# Altium project LocalizationBoard.PrjPcb
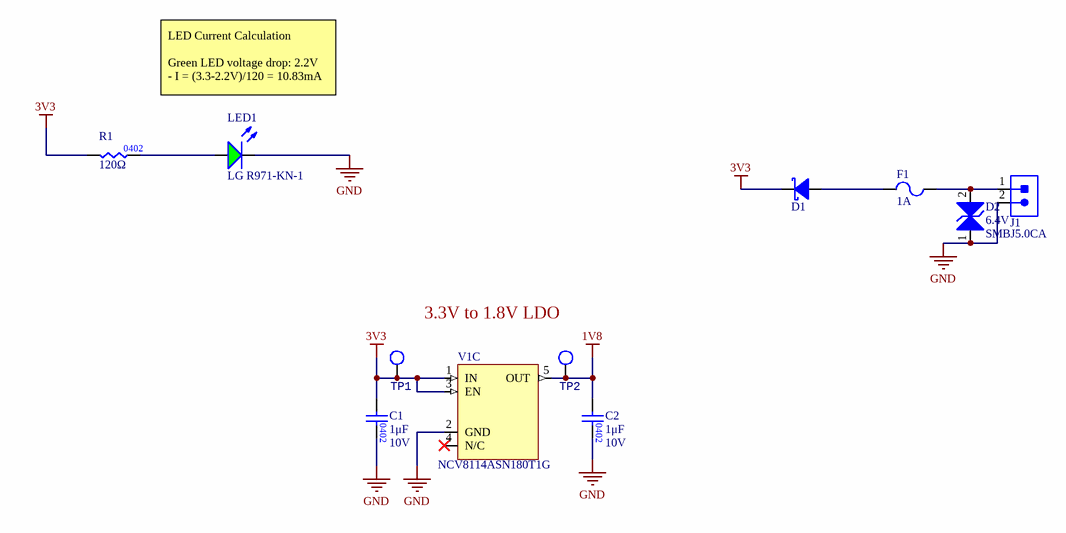
[diagram p0: Power.SchDoc]
designer: Logan Hartford; reviewer: Ari Wasch; total sheets: 6; version: 6.0
2 sheets, 25 parts. Net scope: flat (ports and power ports of the same name join across sheets).
Sheets:
  Power.SchDoc
  CAN.SchDoc

## Sheet Power.SchDoc
size 279 x 215 mm

### Parts
C1  Capacitance: 1μF  Rated DC Voltage (URdc): 10V  [CAP0402]  (hidden comment: CAP_1UF_10V_0402_X5R)
C2  Capacitance: 1μF  Rated DC Voltage (URdc): 10V  [CAP0402]  (hidden comment: CAP_1UF_10V_0402_X5R)
D1  DIO_SCHOTTKY_30V_800mA  [SOD-323_UNIDIR]  (value not drawn)
D2  Voltage - Breakdown (Min): 6.4V  Manufacturer Part Number 1: SMBJ5.0CA  [TVS_DIODE_BIDIR_SMB]  (hidden comment: TVS_DIODE_BIDIR_5V)
F1  Current Rating: 1A  [FUSE_1206]  (hidden comment: FUSE_1A_1206)
J1  CON_2POS_SCREW_TERM  [1935161]  (value not drawn)
LED1  Manufacturer Part Number 1: LG R971-KN-1  [LED_0805_GREEN]  (hidden comment: LED_GREEN)
R1  value 120Ω  [RES0402]
TP1  TESTPOINT_LOOP  [TESTPOINT_LOOP]  (value not drawn)
TP2  TESTPOINT_LOOP  [TESTPOINT_LOOP]  (value not drawn)
V1  NCV8114ASN180T1G  [1.8V_Output_LDO]  (part C of 3)

### Nets
1V8: C2.1 TP2.1 V1.5(OUT)
3V3: C1.1 D1.2(Cathode) R1.1 TP1.1 V1.1(IN) V1.3(EN)
GND: C1.2 C2.2 D2.1 J1.2 LED1.2(K) V1.2(GND)
NetD1_1: D1.1(Anode) F1.1
NetD2_2: D2.2 F1.2 J1.1
NetLED1_1: LED1.1(A) R1.2

Not connected (* = marked no-connect by the designer): V1 4(N/C)*

### Notes on the sheet
- LED Current Calculation
  Green LED voltage drop: 2.2V
  - I = (3.3-2.2V)/120 = 10.83mA
- 3.3V to 1.8V LDO
- University of Waterloo Robotics Team
- 200 University Ave W
- REV
- PROJECT
- Waterloo, Ontario, Canada
- N2L 3G1
- DOCUMENT
- ENGINEER
- REVIEWER
- MODIFIED
- SHEET
- OF

### Library data of the parts
C1 C2 = CAP_1UF_10V_0402_X5R: CAP CER 1UF 10V X5R 0402; Manufacturer: Kyocera AVX; Manufacturer Part Number: 0402ZD105MAT2A; Supplier 1: Digi-Key; Supplier Part Number 1: 478-5768-1-ND; Mounting Type: Surface Mount; Package: 0402; Temperature Characteristics Code: X5R; ComponentLink7URL: https://datasheet.ciiva.com/11531/cx5r-11531784.pdf?src-supplier=Avnet; ComponentLink7Description: https://datasheet.ciiva.com/11531/cx5r-11531784.pdf?src-supplier=Avnet
D1 = DIO_SCHOTTKY_30V_800mA: DIODE SCHOTTKY 30V 800MA USC; Manufacturer 1: Toshiba Semiconductor and Storage; Manufacturer Part Number 1: CUS08F30,H3F; Vf (Max): 220mV; Supplier 1: Digi-Key; Supplier Part Number 1: CUS08F30H3FCT-ND; Mounting Type: SMD; Vr (Max): 30V; Io: 800mA
D2 = TVS_DIODE_BIDIR_5V: TVS DIODE 5V 9.2V SMB; Manufacturer 1: Littelfuse; Package/Footprint: SMB; Supplier Part Number 1: SMBJ5.0CALFCT-ND; Supplier 1: Digi-Key; Mounting Type: SMD; Voltage - Reverse Standoff (Typ): 5V; Voltage - Clamping (Max) @ Ipp: 9.2V; Verified: No; LCSC Part #: *
F1 = FUSE_1A_1206: FUSE BOARD MOUNT 1A 125VAC 63VDC; Manufacturer 1: Bel Fuse Inc.; Manufacturer Part Number 1: C1Q 1; Package/Footprint: 1206; Supplier 1: Digi-Key; Supplier Part Number 1: 507-1077-1-ND; Mounting Type: SMD; LCSC Part #: *
J1 = CON_2POS_SCREW_TERM: TERM BLK 2POS SIDE ENTRY 5MM; Manufacturer 1: Phoenix Contact; Package/Footprint: SMD; Supplier 1: Digi-Key; Mounting Type: TH; Supplier Part Number 1: 277-1667-ND; Manufacturer Part Number 1: 1935161
LED1 = LED_GREEN: LED GREEN DIFFUSED 0805 SMD; Manufacturer 1: OSRAM; Forward Voltage Drop: 2.2V; Package/Footprint: 0805; Supplier Part Number 1: 475-1410-1-ND; Supplier 1: Digi-Key; Mounting Type: SMD
R1 = RES_120Ω_0402_5%: RES 120 OHM 5% 1/16W 0402; Manufacturer Part Number 1: RC0402JR-07120RL; Manufacturer 1: Yageo; Package/Footprint: 0402; Supplier 1: Digi-Key; Supplier Part Number 1: 311-120JRCT-ND; Mounting Type: SMD; Power: 1/16W; Tolerance: 5%
TP1 TP2 = TESTPOINT_LOOP: TESTPOINT THRUHOLE; Manufacturer 1: Keystone Electronics; Manufacturer Part Number 1: 5002; Package/Footprint: TH; Supplier Part Number 1: 36-5002-ND; Supplier 1: Digi-Key; Mounting Type: TH
V1 = 1.8V_Output_LDO: Linear Voltage Regulator IC Positive Fixed 1 Output 300mA 5-TSOP; Manufacture: onsemi; Output voltage: 1.8V; Manufacture part number: NCV8114ASN180T1G; Package: SOT-23-5 Thin, TSOT-23-5; Mounting type: Surface Mount; Supplier: Digikey; ComponentLink1Description: Datasheet; ComponentLink1URL: https://www.digikey.ca/en/products/detail/onsemi/NCV8114ASN180T1G/7066765

## Sheet CAN.SchDoc
size A4
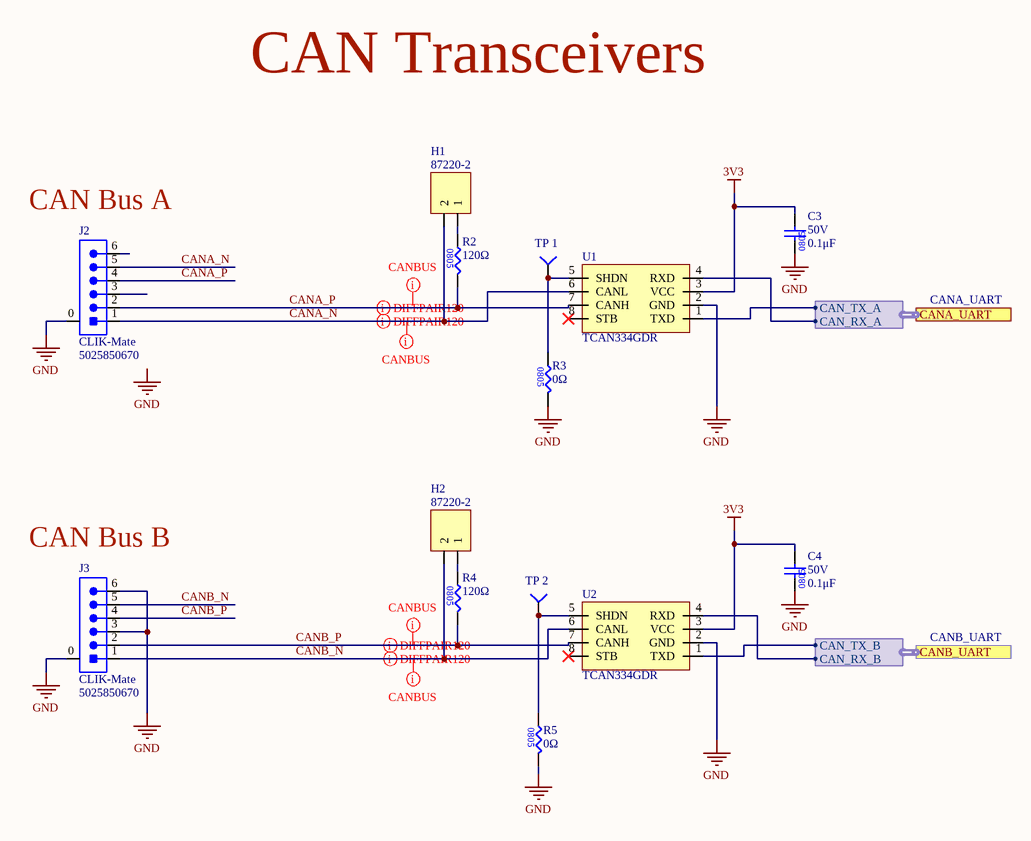
[diagram p1: CAN.SchDoc]

### Parts
C3  value 0.1μF  Voltage Rating: 50V  [CAP2012]  (hidden comment: CAP_0.1uF_50V_0805)
C4  value 0.1μF  Voltage Rating: 50V  [CAP2012]  (hidden comment: CAP_0.1uF_50V_0805)
H1  Manufacturer Part Number 1: 87220-2  [HDR1X2]  (hidden comment: JUMPER_2)
H2  Manufacturer Part Number 1: 87220-2  [HDR1X2]  (hidden comment: JUMPER_2)
J2  Family: CLIK-Mate  Manufacturer Part Number 1: 5025850670  [MOLEX-5025850670]  (hidden comment: CON_6M_SM_RA_1.5mm)
J3  Family: CLIK-Mate  Manufacturer Part Number 1: 5025850670  [MOLEX-5025850670]  (hidden comment: CON_6M_SM_RA_1.5mm)
R2  value 120Ω  [RES0805]  (hidden comment: RES_120Ω_0805_1%)
R3  value 0Ω  [RES0805]  (hidden comment: RES_0Ω_0805)
R4  value 120Ω  [RES0805]  (hidden comment: RES_120Ω_0805_1%)
R5  value 0Ω  [RES0805]  (hidden comment: RES_0Ω_0805)
TP_1  TESTPOINT_1MM_CIRCLE  [TESTPOINT_CIRCLE_1MM]  (value not drawn)  (no BOM)
TP_2  TESTPOINT_1MM_CIRCLE  [TESTPOINT_CIRCLE_1MM]  (value not drawn)  (no BOM)
U1  Manufacturer Part Number 1: TCAN334GDR  [SOIC127P600X175-8N]  (hidden comment: IC_CAN_TRANSCEIVER)
U2  Manufacturer Part Number 1: TCAN334GDR  [SOIC127P600X175-8N]  (hidden comment: IC_CAN_TRANSCEIVER)

### Ports
CANA_UART (harness CANA_UART), CANB_UART (harness CANB_UART)

### Harnesses
CANA_UART: CAN_RX_A, CAN_TX_A
CANB_UART: CAN_RX_B, CAN_TX_B

### Nets
3V3: C3.2 C4.2 U1.3(VCC) U2.3(VCC)
GND: C3.1 C4.1 J2.0 J3.0 J3.3 J3.6 R3.2 R5.2 U1.2(GND) U2.2(GND)
CANA_N: H1.2 J2.1 J2.5 U1.6(CANL)
CANA_P: J2.2 J2.4 R2.2 U1.7(CANH)
CANB_N: H2.2 J3.1 J3.5 U2.6(CANL)
CANB_P: J3.2 J3.4 R4.2 U2.7(CANH)
NetH1_1: H1.1 R2.1
NetH2_1: H2.1 R4.1
NetR3_1: R3.1 TP_1.1(=value) U1.5(SHDN)
NetR5_1: R5.1 TP_2.1(=value) U2.5(SHDN)
NetU1_1: U1.1(TXD) ; port CANA_UART.CAN_TX_A
NetU1_4: U1.4(RXD) ; port CANA_UART.CAN_RX_A
NetU2_1: U2.1(TXD) ; port CANB_UART.CAN_TX_B
NetU2_4: U2.4(RXD) ; port CANB_UART.CAN_RX_B

Not connected (* = marked no-connect by the designer): J2 3 6; U1 8(STB)*; U2 8(STB)*

### Layout directives
differential pair; differential pair class CANBUS120: CANA_N, CANA_P, CANB_N, CANB_P
mark named CANBUS: (no net found under the mark), CANA_N, CANB_N, CANB_P

### Notes on the sheet
- CAN Transceivers
- (near J2) CAN Bus A
- (near J3) CAN Bus B
- Labels drawn without touching a wire or pin: GND

### Library data of the parts
C3 C4 = CAP_0.1uF_50V_0805: CAP CER 0.1UF 50V X7R 0805; Manufacturer Part Number 1: GCM21BR71H104KA37K; Manufacturer 1: Murata Electronics; Package/Footprint: 0805; Supplier Part Number 1: 490-8049-1-ND; Supplier 1: Digi-Key; Dielectric: X7R; LCSC Part #: C49678; Mounting Type: SMD
H1 H2 = JUMPER_2: HEADER 2X1; Manufacturer 1: TE Connectivity; Package/Footprint: TH; Supplier 1: Digi-Key; Supplier Part Number 1: A26542-ND; Mount: Through Hole; Mounting Type: TH
J2 J3 = CON_6M_SM_RA_1.5mm: CONN HEADER SMD RIGHT ANGLE 1.5 MM PITCH; Manufacturer 1: Molex; Supplier 1: Digi-Key; Supplier Part Number 1: WM12832CT-ND; Package/Footprint: SMD; Mounting Type: SMD
R2 R4 = RES_120Ω_0805_1%: RES 120 OHM 1% 1/8W 0805; Manufacturer 1: Vishay; Manufacturer Part Number 1: CRCW0805120RFKEA; Package/Footprint: 0805; Supplier Part Number 1: 541-120CCT-ND; Supplier 1: Digi-Key; LCSC Part #: C17437; Mounting Type: SMD
R3 R5 = RES_0Ω_0805: RES 0 OHM JUMPER 1/8W 0805; Manufacturer 1: Panasonic Electronic Components; Manufacturer Part Number 1: ERJ-6GEY0R00V; Package/Footprint: 0805; Supplier Part Number 1: P0.0ACT-ND; Supplier 1: Digi-Key; LCSC Part #: C17477; Mounting Type: SMD
TP_1 TP_2 = TESTPOINT_1MM_CIRCLE: TESTPOINT 1MM CIRCLE
U1 U2 = IC_CAN_TRANSCEIVER: IC TRANSCEIVER 1/1 8SOIC; Manufacturer 1: Maxim; Package/Footprint: 14-SOIC; Mounting Type: SMD; Supplier 1: Digi-Key; Supplier Part Number 1: 296-49940-1-ND

## Nets that join several sheets
3V3: Power (6 pins), CAN (C3.2 C4.2 U1.3 U2.3)
GND: Power (6 pins), CAN (10 pins)

## Assembly variants
Only Populated Components: not fitted R28 R31 R44 R47 R60 R77